# Altium schematic sheet PSU.SchDoc
size A4; SheetNumber: 2; SheetTotal: 2
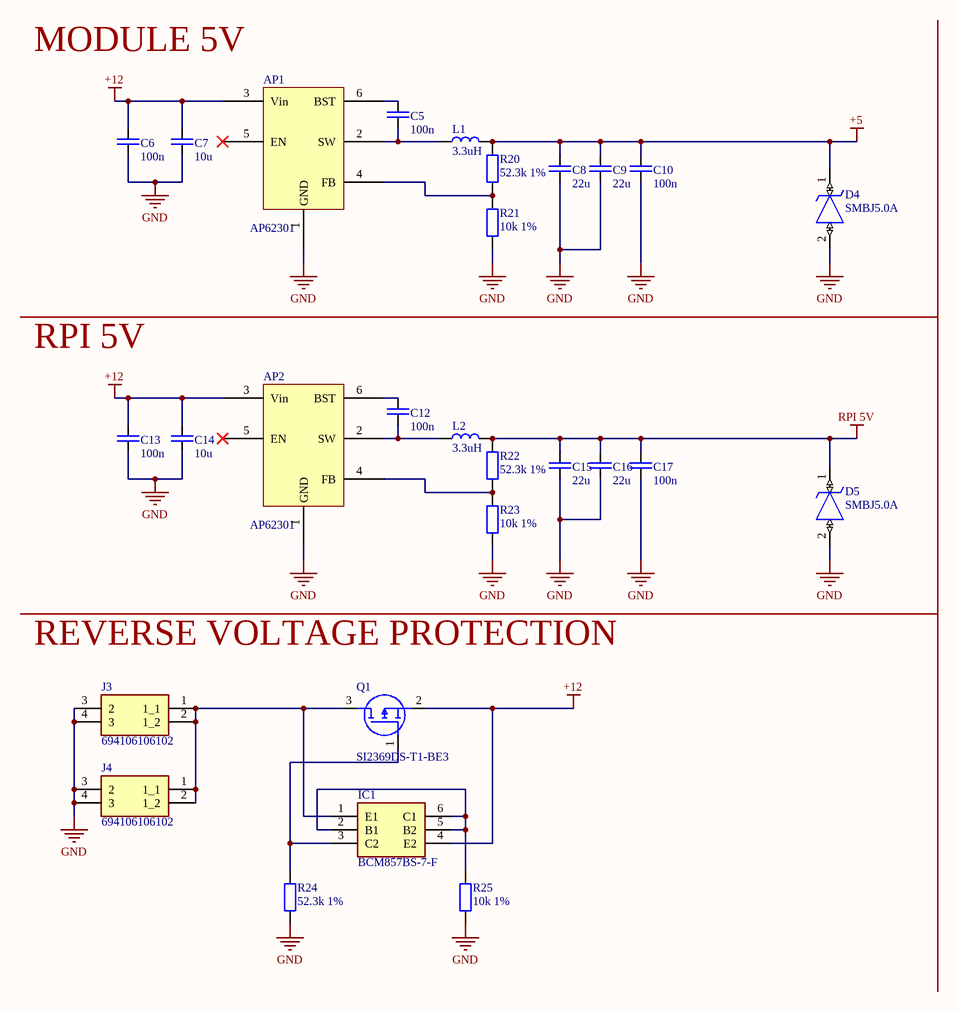
[diagram p0: PSU.SchDoc]

## Parts
AP1  AP62301  [SOT95P280X100-6L]
AP2  AP62301  [SOT95P280X100-6L]
C5  100n  [C3216_1206I_L]
C6  100n  [C3216_1206I_L]
C7  10u  [C3225_1210I_L]
C8  22u  [C3225_1210I_L]
C9  22u  [C3225_1210I_L]
C10  100n  [C3216_1206I_L]
C12  100n  [C3216_1206I_L]
C13  100n  [C3216_1206I_L]
C14  10u  [C3225_1210I_L]
C15  22u  [C3225_1210I_L]
C16  22u  [C3225_1210I_L]
C17  100n  [C3216_1206I_L]
D4  SMBJ5.0A  [DIOM5436X261N]
D5  SMBJ5.0A  [DIOM5436X261N]
IC1  BCM857BS-7-F  [SOT65P210X110-6N]
J3  694106106102  [694106106102]
J4  694106106102  [694106106102]
L1  3.3uH  [INDUCTOR_2]
L2  3.3uH  [INDUCTOR_2]
Q1  SI2369DS-T1-BE3  [SOT95P237X112-3N]
R20  52.3k 1%  [R1005_0402i_L]
R21  10k 1%  [R1005_0402i_L]
R22  52.3k 1%  [R1005_0402i_L]
R23  10k 1%  [R1005_0402i_L]
R24  52.3k 1%  [R1005_0402i_L]
R25  10k 1%  [R1005_0402i_L]

## Nets
+5: C8.1 C9.1 C10.1 D4.1(K) L1.2 R20.1
+12: AP1.3(Vin) AP2.3(Vin) C6.1 C7.1 C13.1 C14.1 IC1.4(E2) Q1.2(S)
GND: AP1.1(GND) AP2.1(GND) C6.2 C7.2 C8.2 C9.2 C10.2 C13.2 C14.2 C15.2 C16.2 C17.2 D4.2(A) D5.2(A) J3.3(2) J3.4(3) J4.3(2) J4.4(3) R21.2 R23.2 R24.2 R25.2
RPI 5V: C15.1 C16.1 C17.1 D5.1(K) L2.2 R22.1
NetAP1_2: AP1.2(SW) C5.2 L1.1
NetAP1_4: AP1.4(FB) R20.2 R21.1
NetAP1_6: AP1.6(BST) C5.1
NetAP2_2: AP2.2(SW) C12.2 L2.1
NetAP2_4: AP2.4(FB) R22.2 R23.1
NetAP2_6: AP2.6(BST) C12.1
NetIC1_1: IC1.1(E1) J3.1(1_1) J3.2(1_2) J4.1(1_1) J4.2(1_2) Q1.3(D)
NetIC1_2: IC1.2(B1) IC1.5(B2) IC1.6(C1) R25.1
NetIC1_3: IC1.3(C2) Q1.1(G) R24.1

Not connected (* = marked no-connect by the designer): AP1 5(EN)*; AP2 5(EN)*

## Notes on the sheet
- MODULE 5V
- RPI 5V
- REVERSE VOLTAGE PROTECTION

## Library data of the parts
C5-C10 C12-C17 = C: Capacitor
D4 D5 = SMBJ5.0A: TVS Diode (Uni-directional); Manufacturer_Name: LITTELFUSE; Datasheet Link: https://www.mouser.co.uk/datasheet/2/240/Littelfuse_TVS_Diode_SMBJ_Datasheet.pdf-1108540.pdf; Height: 2.61mm; Manufacturer_Part_Number: SMBJ5.0A; Mouser Part Number: 576-SMBJ5.0A; Mouser Price/Stock: https://www.mouser.co.uk/ProductDetail/Littelfuse/SMBJ5.0A?qs=JJML70Qc14t9tktzNr1oMQ%3D%3D; Arrow Part Number: SMBJ5.0A; Arrow Price/Stock: https://www.arrow.com/en/products/smbj5.0a/littelfuse?region=europe
IC1 = BCM857BS-7-F: Integrated Circuit; Manufacturer_Name: Diodes Incorporated; Datasheet Link: https://mouser.componentsearchengine.com/Datasheets/1/BCM857BS-7-F.pdf; Height: 1.1mm; Manufacturer_Part_Number: BCM857BS-7-F; Mouser Part Number: 621-BCM857BS-7-F; Mouser Price/Stock: https://www.mouser.co.uk/ProductDetail/Diodes-Incorporated/BCM857BS-7-F?qs=60RJRzIpcl83Pda4UUWqGw%3D%3D; Arrow Part Number: BCM857BS-7-F; Arrow Price/Stock: https://www.arrow.com/en/products/bcm857bs-7-f/diodes-incorporated?region=nac
J3 J4 = 694106106102: Connector; Manufacturer_Name: Wurth Elektronik; Datasheet Link: http://www.mouser.com/ds/2/445/6941xx106102-469316.pdf; Manufacturer_Part_Number: 694106106102; Mouser Part Number: 710-694106106102; Mouser Price/Stock: https://www.mouser.co.uk/ProductDetail/Wurth-Elektronik/694106106102?qs=a9WhcLg8qCzYTlt%252B9%252BRJ7g%3D%3D
L1 L2 = L
Q1 = SI2369DS-T1-BE3: MOSFET (P-Channel); Manufacturer_Name: Vishay; Datasheet Link: https://www.mouser.com/datasheet/2/427/si2369d-1764360.pdf; Height: 1.12mm; Manufacturer_Part_Number: SI2369DS-T1-BE3; Mouser Part Number: 78-SI2369DS-T1-BE3; Mouser Price/Stock: https://www.mouser.co.uk/ProductDetail/Vishay-Siliconix/SI2369DS-T1-BE3?qs=CiayqK2gdcIOn%252BvoBWrtBg%3D%3D; Arrow Part Number: SI2369DS-T1-BE3; Arrow Price/Stock: https://www.arrow.com/en/products/si2369ds-t1-be3/vishay?region=nac
R20-R25 = R